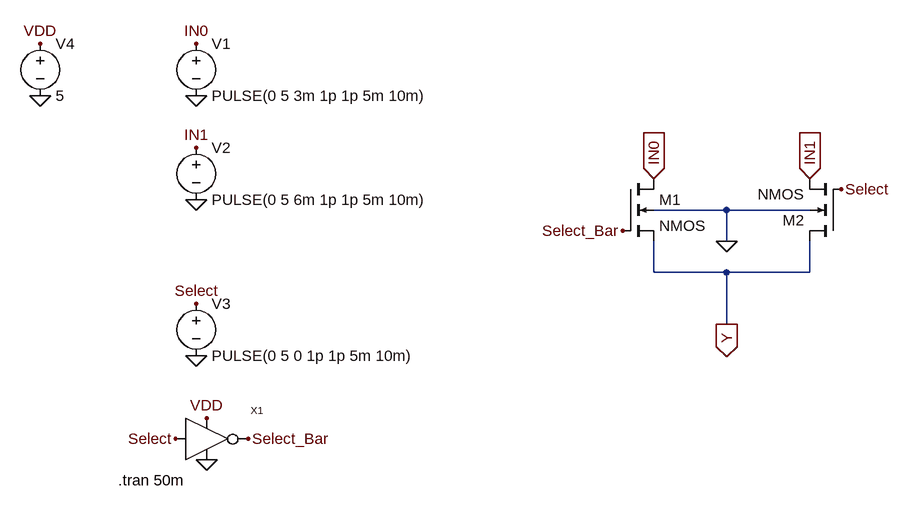
[diagram p0: schematic Mux_PTL_TestCircuit.asc]
Mux_PTL_TestCircuit.asc, the LTspice schematic file:
Version 4
SHEET 1 1012 680
WIRE 608 96 496 96
WIRE 736 96 608 96
WIRE 608 144 608 96
WIRE 496 192 496 144
WIRE 608 192 496 192
WIRE 736 192 736 144
WIRE 736 192 608 192
WIRE 608 272 608 192
FLAG -208 -80 0
FLAG -208 80 0
FLAG -208 320 0
FLAG -208 -160 IN0
FLAG -208 0 IN1
FLAG -208 240 Select
FLAG 496 48 IN0
IOPIN 496 48 In
FLAG 736 48 IN1
IOPIN 736 48 In
FLAG -448 -160 VDD
FLAG -448 -80 0
FLAG -192 416 VDD
FLAG -192 480 0
FLAG -128 448 Select_Bar
FLAG -240 448 Select
FLAG 784 64 Select
FLAG 448 128 Select_Bar
FLAG 608 144 0
FLAG 608 272 Y
IOPIN 608 272 Out
SYMBOL nmos4 448 48 R0
SYMATTR InstName M1
SYMBOL nmos4 784 144 R180
SYMATTR InstName M2
SYMBOL voltage -208 -176 R0
WINDOW 123 0 0 Left 0
WINDOW 39 0 0 Left 0
SYMATTR InstName V1
SYMATTR Value PULSE(0 5 3m 1p 1p 5m 10m)
SYMBOL voltage -208 -16 R0
WINDOW 123 0 0 Left 0
WINDOW 39 0 0 Left 0
SYMATTR InstName V2
SYMATTR Value PULSE(0 5 6m 1p 1p 5m 10m)
SYMBOL voltage -208 224 R0
WINDOW 123 0 0 Left 0
WINDOW 39 0 0 Left 0
SYMATTR InstName V3
SYMATTR Value PULSE(0 5 0 1p 1p 5m 10m)
SYMBOL CMOS_Inverter -224 480 R0
SYMATTR InstName X1
SYMBOL voltage -448 -176 R0
SYMATTR InstName V4
SYMATTR Value 5
TEXT -328 512 Left 2 !.tran 50m

The netlist it stands for:
* Mux_PTL_TestCircuit.asc
M1 IN0 Select_Bar Y 0 NMOS
M2 Y Select IN1 0 NMOS
V1 IN0 0 PULSE(0 5 3m 1p 1p 5m 10m)
V2 IN1 0 PULSE(0 5 6m 1p 1p 5m 10m)
V3 Select 0 PULSE(0 5 0 1p 1p 5m 10m)
XX1 VDD 0 Select Select_Bar CMOS_Inverter  ; pins VPOS VNEG VIN VOUT
V4 VDD 0 5
.model NMOS NMOS
.model PMOS PMOS
.lib standard.mos
.tran 50m
.backanno
.end